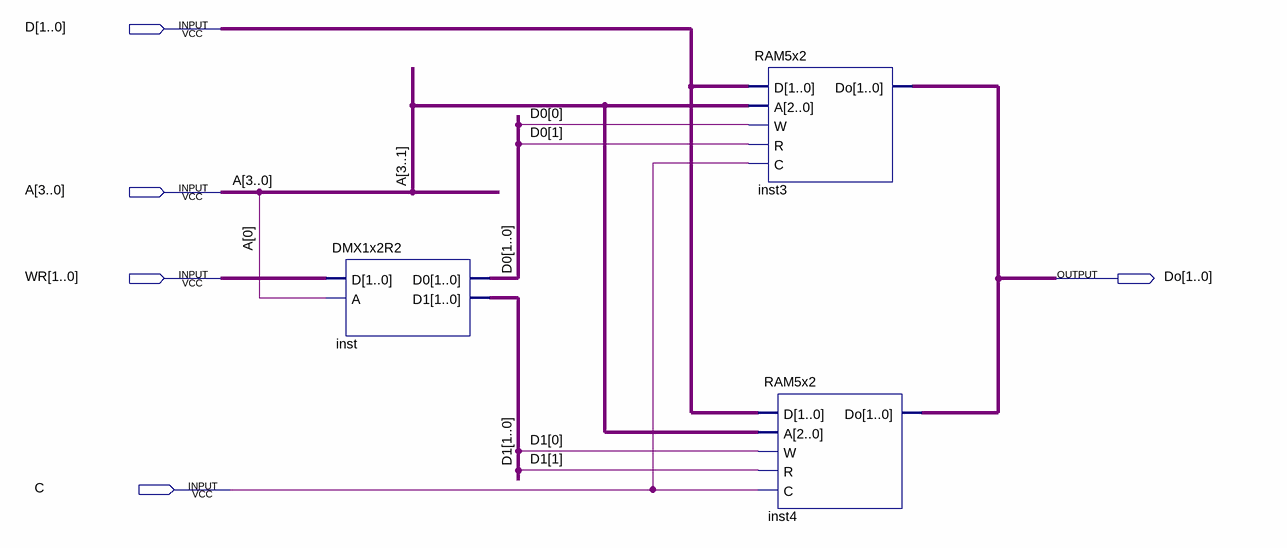
[diagram p0: schematic sheet]
// Quartus schematic RAM10x2b.bdf as structural Verilog: 3 symbols, 5 pins
module RAM10x2b (
  input  [1:0] D,
  input  [3:0] A,
  input  [1:0] WR,
  input  C,
  output [1:0] Do
);

  wire [1:0] D0, D1;

  DMX1x2R2 inst (.D(WR), .A(A[0]), .D0(D0), .D1(D1));
  RAM5x2 inst3 (.D(D), .A(A[3:1]), .W(D0[0]), .R(D0[1]), .C(C), .Do(Do));
  RAM5x2 inst4 (.D(D), .A(A[3:1]), .W(D1[0]), .R(D1[1]), .C(C), .Do(Do));
endmodule
